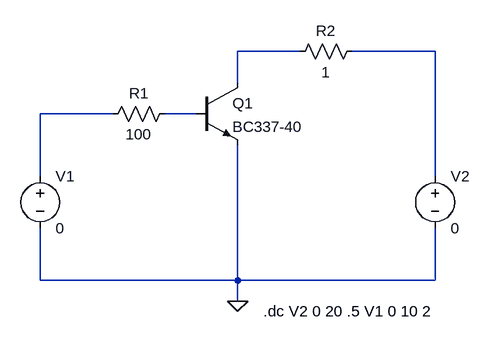
[diagram p0: schematic dc-sweep.asc]
dc-sweep.asc, the LTspice schematic file:
Version 4
SHEET 1 880 680
WIRE 416 -48 320 -48
WIRE 624 -48 496 -48
WIRE 320 0 320 -48
WIRE 128 48 16 48
WIRE 256 48 208 48
WIRE 16 144 16 48
WIRE 624 144 624 -48
WIRE 16 304 16 224
WIRE 320 304 320 96
WIRE 320 304 16 304
WIRE 624 304 624 224
WIRE 624 304 320 304
WIRE 320 336 320 304
FLAG 320 336 0
SYMBOL voltage 16 128 R0
SYMATTR InstName V1
SYMATTR Value 0
SYMBOL res 224 32 R90
WINDOW 0 0 56 VBottom 2
WINDOW 3 32 56 VTop 2
SYMATTR InstName R1
SYMATTR Value 100
SYMBOL npn 256 0 R0
SYMATTR InstName Q1
SYMATTR Value BC337-40
SYMBOL res 512 -64 R90
WINDOW 0 0 56 VBottom 2
WINDOW 3 32 56 VTop 2
SYMATTR InstName R2
SYMATTR Value 1
SYMBOL voltage 624 128 R0
SYMATTR InstName V2
SYMATTR Value 0
TEXT 360 352 Left 2 !.dc V2 0 20 .5 V1 0 10 2

The netlist it stands for:
* dc-sweep.asc
V1 N003 0 0
R1 N004 N003 100
Q1 N001 N004 0 0 BC337-40
R2 N002 N001 1
V2 N002 0 0
.model NPN NPN
.model PNP PNP
.lib standard.bjt
.dc V2 0 20 .5 V1 0 10 2
.backanno
.end